# EasyEDA Pro project Master board.epro

# Schematic Schematic1
Board Name: MASTER; Create Date: 2026-03-29; Page Name: P1; Project Name: rs485 master; Schematic Name: Schematic1; Update Date: 2026-04-01; Company: EasyEDA.com; Page Size: A4; Version: V1.0
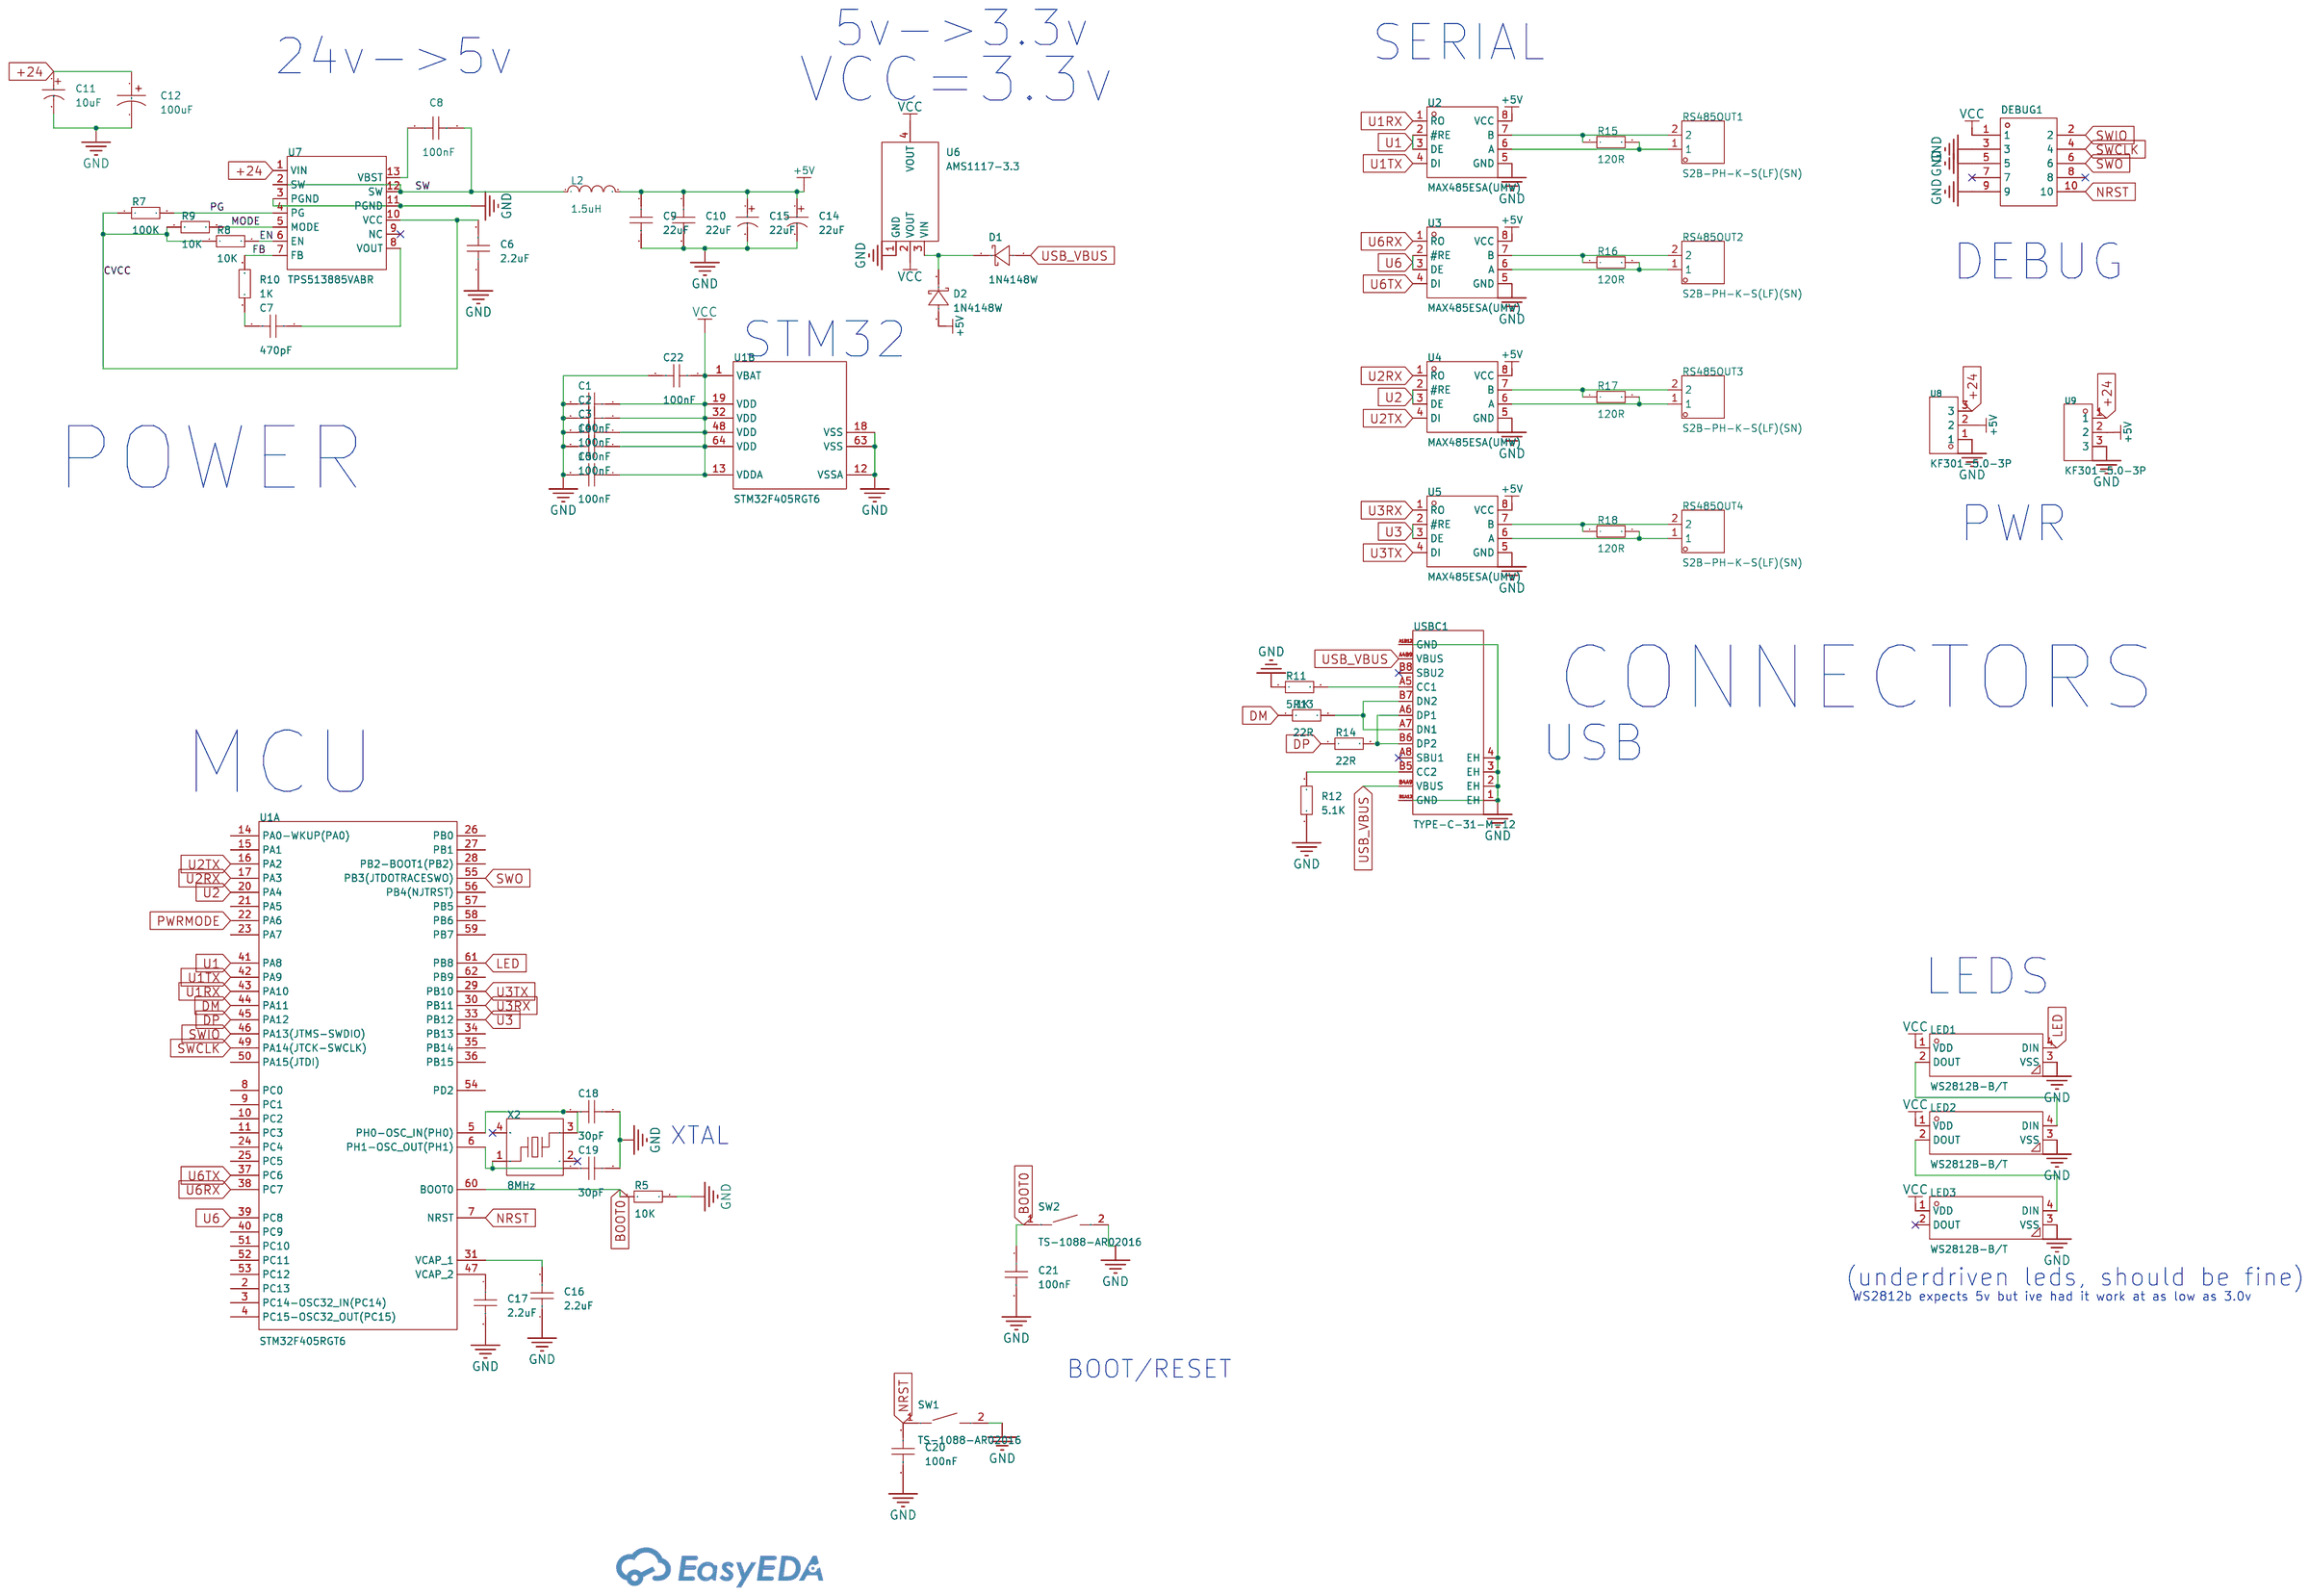
[diagram p0: schematic sheet]

## Parts
C1  100nF  [C0603]
C2  100nF  [C0603]
C3  100nF  [C0603]
C4  100nF  [C0603]
C5  100nF  [C0603]
C6  2.2uF  [C0603]
C7  470pF  [C0603]
C8  100nF  [C0603]
C9  22uF  [C0603]
C10  22uF  [C0603]
C11  10uF  [CAP-TH_BD5.0-P2.00-D0.8-FD]
C12  100uF  [CAP-TH_BD6.0-P2.50-D0.5-FD]
C14  22uF  [CAP-TH_BD4.0-P1.50-D0.8-FD]
C15  22uF  [CAP-TH_BD4.0-P1.50-D0.8-FD]
C16  2.2uF  [C0603]
C17  2.2uF  [C0603]
C18  30pF  [C0603]
C19  30pF  [C0603]
C20  100nF  [C0603]
C21  100nF  [C0603]
C22  100nF  [C0603]
D1  1N4148W  [SOD-123_L2.7-W1.6-LS3.7-FD]
D2  1N4148W  [SOD-123_L2.7-W1.6-LS3.7-FD]
DEBUG1  -  [HDR-TH_10P-P2.54-V-M-R2-C5-S2.54]
L2  1.5uH  [IND-SMD_L7.0-W6.6]
LED1  WS2812B-B/T  [LED-SMD_4P-L5.0-W5.0-TL_WS2812B-B]
LED2  WS2812B-B/T  [LED-SMD_4P-L5.0-W5.0-TL_WS2812B-B]
LED3  WS2812B-B/T  [LED-SMD_4P-L5.0-W5.0-TL_WS2812B-B]
R5  10K  [R0603]
R7  100K  [R0603]
R8  10K  [R0603]
R9  10K  [R0603]
R10  1K  [R0603]
R11  5.1K  [R0603]
R12  5.1K  [R0603]
R13  22R  [R0603]
R14  22R  [R0603]
R15  120R  [R0603]
R16  120R  [R0603]
R17  120R  [R0603]
R18  120R  [R0603]
RS485OUT1  S2B-PH-K-S(LF)(SN)  [CONN-TH_S2B-PH-K-S-LF-SN]
RS485OUT2  S2B-PH-K-S(LF)(SN)  [CONN-TH_S2B-PH-K-S-LF-SN]
RS485OUT3  S2B-PH-K-S(LF)(SN)  [CONN-TH_S2B-PH-K-S-LF-SN]
RS485OUT4  S2B-PH-K-S(LF)(SN)  [CONN-TH_S2B-PH-K-S-LF-SN]
SW1  TS-1088-AR02016  [SW-SMD_L3.9-W3.0-P4.45]
SW2  TS-1088-AR02016  [SW-SMD_L3.9-W3.0-P4.45]
U1  STM32F405RGT6  [LQFP-64_L10.0-W10.0-P0.50-LS12.0-BL]  (sections 1,2)
U2  MAX485ESA(UMW)  [SOP-8_L5.0-W4.0-P1.27-LS6.0-BL]
U3  MAX485ESA(UMW)  [SOP-8_L5.0-W4.0-P1.27-LS6.0-BL]
U4  MAX485ESA(UMW)  [SOP-8_L5.0-W4.0-P1.27-LS6.0-BL]
U5  MAX485ESA(UMW)  [SOP-8_L5.0-W4.0-P1.27-LS6.0-BL]
U6  AMS1117-3.3  [SOT-223-3_L6.5-W3.4-P2.30-LS7.0-BR]
U7  TPS513885VABR  [VQFN-HR-13_L4.0-W3.0_TPS51388VABR]
U8  KF301-5.0-3P  [CONN-TH_3P-P5.00_KF301-5.0-3P]
U9  KF301-5.0-3P  [CONN-TH_3P-P5.00_KF301-5.0-3P]
USBC1  TYPE-C-31-M-12  [USB-C_SMD-TYPE-C-31-M-12_1]
X2  8MHz  [CRYSTAL-SMD_4P-L3.2-W2.5-BL]

## Library data of the parts
C1-C10 C18 C19 C22 = CAP_0603: Supplier Footprint: 0603
C11 = ERS1HM100D11OT: Capacitance:10uF Tolerance:±20% Tolerance:±20% Voltage Rating:50V Pin Spacing:2mm Diameter:5mm Height - Seated (Max):11mm Lifetime:5000hrs@105℃; LCSC Part Name: 10uF ±20% 50V; Supplier Part: C106654; Manufacturer: AISHI(艾华集团); Supplier Footprint: 插件,D5xL11mm; JLCPCB Part Class: Extended Part; Datasheet: https://item.szlcsc.com/datasheet/ERS1HM100D11OT/107870.html; Supplier: LCSC; Tolerance: ±20%; Voltage Rating: 50V; Pin Spacing: 2mm; Diameter: 5mm; Height - Seated (Max): 11mm; Lifetime: 5000hrs@105℃
C12 = KM1V101M0611: Capacitance:100uF Tolerance:±20% Tolerance:±20% Voltage Rating:35V Pin Spacing:- Diameter:6mm Height - Seated (Max):11mm Operating Temperature:-40℃~+105℃ Operating Temperature:-40℃~+105℃; LCSC Part Name: 100uF ±20% 35V; Supplier Part: C2873963; Manufacturer: ROQANG(容强); Supplier Footprint: 插件,D6xL11mm; JLCPCB Part Class: Extended Part; Datasheet: https://item.szlcsc.com/datasheet/KM1V101M0611/3078446.html; Supplier: LCSC; Tolerance: ±20%; Voltage Rating: 35V; Diameter: 6mm; Height - Seated (Max): 11mm; Operating Temperature: -40℃~+105℃
C14 C15 = KS226M025C07RR0VH2FP0: Capacitance:22uF Tolerance:±20% Tolerance:±20% Voltage Rating:25V Ripple Current:- Equivalent Series Resistance(ESR):- Pin Spacing:1.5mm Diameter:4mm Height - Seated (Max):7mm Lifetime:1000hrs@105℃ Operating Temperature:-40℃~+105℃ Operating Temperature:-4; LCSC Part Name: 22uF ±20% 25V; Supplier Part: C43840; Manufacturer: Chengx(承兴); Supplier Footprint: 插件,D4xL7mm; JLCPCB Part Class: Extended Part; Datasheet: https://item.szlcsc.com/datasheet/KS226M025C07RR0VH2FP0/44842.html; Supplier: LCSC; Tolerance: ±20%; Voltage Rating: 25V; Pin Spacing: 1.5mm; Diameter: 4mm; Height - Seated (Max): 7mm; Lifetime: 1000hrs@105℃; Operating Temperature: -40℃~+105℃
C16 C17 C20 C21 = CAP_0603: Supplier Footprint: 0603; Check: false
D1 D2 = 1N4148W_C7420318: Diode Configuration:Independent Voltage - Forward(Vf@If):1.25V@150mA Voltage - DC Reverse(Vr):100V Current - Rectified:150mA Pd - Power Dissipation:400mW Reverse Leakage Current (Ir):1uA@75V Reverse Recovery Time (trr):4ns Operating Junction Temperature R; LCSC Part Name: 100V 150mA; Supplier Part: C7420318; Manufacturer: R+O(宏嘉诚); Supplier Footprint: SOD-123; JLCPCB Part Class: Extended Part; Datasheet: https://item.szlcsc.com/datasheet/1N4148W/8397140.html; Supplier: LCSC; Diode Configuration: Independent; Voltage - Forward(Vf@If): 1.25V@150mA; Voltage - DC Reverse(Vr): 100V; Current - Rectified: 150mA; Pd - Power Dissipation: 400mW; Reverse Leakage Current (Ir): 1uA@75V; Reverse Recovery Time (trr): 4ns; Operating Junction Temperature Range: -55℃~+150℃; Non-Repetitive Peak Forward Surge Current: 2A
DEBUG1 = HDR-M_2.54_2x5: Supplier Footprint: Through; Check: false
L2 = FXL0630-1R5-M: Inductance:1.5uH Tolerance:±20% Tolerance:±20% Current Rating:12A Current - Saturation(Isat):14A DC Resistance(DCR):12.1mΩ Type:Molded Inductor; LCSC Part Name: 1.5uH ±20% 14A; Supplier Part: C167217; Manufacturer: cjiang(长江微电); Supplier Footprint: SMD,7x6.6mm; JLCPCB Part Class: Extended Part; Datasheet: https://item.szlcsc.com/datasheet/FXL0630-1R5-M/178600.html; Supplier: LCSC; Tolerance: ±20%; Current Rating: 12A; Current - Saturation(Isat): 14A; DC Resistance(DCR): 12.1mΩ; Type: Molded Inductor
LED1-LED3 = WS2812B-B/T: Wavelength:520nm；471nm；621nm Luminous Intensity:R:300mcd~500mcd；B:200mcd~300mcd；G:600mcd~1000mcd Fixed-Frequency Pwm Mode:2kHz Data Transmission Rate:800Kbit/s Voltage - Supply:- Voltage - Supply:- Quiescent Current:0.6mA Lens Color:- Peak Wavelength:G:52; LCSC Part Name: RGB三色; Supplier Part: C2761795; Manufacturer: worldsemi; Supplier Footprint: SMD5050-4P; JLCPCB Part Class: Extended Part; Datasheet: https://item.szlcsc.com/datasheet/WS2812B-B%252FT/2886707.html; Supplier: LCSC; Wavelength: 520nm；471nm；621nm; Luminous Intensity: R:300mcd~500mcd；B:200mcd~300mcd；G:600mcd~1000mcd; Fixed-Frequency Pwm Mode: 2kHz; Data Transmission Rate: 800Kbit/s; Quiescent Current: 0.6mA; Peak Wavelength: G:520nm；R:621nm；B:471nm; Length: 5mm; Width: 1.57mm; Height: 5.4mm
R5 = Res_0603: Supplier Footprint: 0603; Check: false
R7-R18 = Res_0603: Supplier Footprint: 0603
RS485OUT1-RS485OUT4 = S2B-PH-K-S(LF)(SN): Pins Structure:1x2P Pitch:2mm Mounting Type:Right Angle Reference Series:PH Number of Pins:2P Number of Rows:1 Number of PINs Per Row:2 Row Spacing:- Current Rating:2A Contact Material:Brass Contact Plating:Tin Operating Temperature:-25℃~+85℃ Operating Te; LCSC Part Name: 1x2P 间距:2mm 弯插 系列:PH; Supplier Part: C173752; Manufacturer: JST; Supplier Footprint: 弯插,P=2mm; JLCPCB Part Class: Extended Part; Datasheet: https://item.szlcsc.com/datasheet/S2B-PH-K-S(LF)(SN)/185142.html; Supplier: LCSC; Pins Structure: 1x2P; Pitch: 2mm; Mounting Type: Right Angle; Reference Series: PH; Number of Pins: 2P; Number of Rows: 1; Number of PINs Per Row: 2; Current Rating: 2A; Contact Material: Brass; Contact Plating: Tin; Operating Temperature: -25℃~+85℃; Voltage Rating: 100V; Plastic Material: PA66; Flame Retardant Rating: UL94V-0; Supplementary Features: K Pin; Color: White; Z-Height of the Board: 4.8mm; X-Length of Bottom Edge on Board (Spacing Line): 5.9mm; Y-Width of Bottom Edge on Board: 7.6mm
SW1 SW2 = TS-1088-AR02016: Circuit:SPST Actuator Style:Round Button Operating Force:1.6N Mounting Type:Surface Mount,Vertical Length:4mm Width:3mm Switch Height:2mm with Bracket:Without Bracket Contact Current:50mA Voltage Rating:12V Actuator/Cap Color:Black Termination Style:SMD(S; LCSC Part Name: 4*3*2mm 立贴 轻触开关; Supplier Part: C720477; Manufacturer: XUNPU(讯普); Supplier Footprint: SMD,4x3mm; JLCPCB Part Class: Basic Part; Datasheet: https://item.szlcsc.com/datasheet/TS-1088-AR02016/763484.html; Supplier: LCSC; Circuit: SPST; Actuator Style: Round Button; Operating Force: 1.6N; Mounting Type: Surface Mount,Vertical; Length: 4mm; Width: 3mm; Switch Height: 2mm; with Bracket: Without Bracket; Contact Current: 50mA; Voltage Rating: 12V; Actuator/Cap Color: Black; Termination Style: SMD(SMT) Tab; Life: 100,000 Cycles; Operating Temperature: -30℃~+80℃
U1 = STM32F405RGT6: CPU Core:ARM-M4 CPU Maximum Speed:168MHz Program Storage Size:1MB Program Memory Type:FLASH Number of I/O:51 ADC (Bit):12bit DAC (Bit):12bit Voltage - Supply:1.8V~3.6V Voltage - Supply:1.8V~3.6V Applications:-; LCSC Part Name: 带DSP和FPU的高性能基础系列ARM Cortex-M4 MCU，具有1 MB Flash、168 MHz CPU和ART加速器; Supplier Part: C15742; Manufacturer: ST(意法半导体); Supplier Footprint: LQFP-64(10x10); JLCPCB Part Class: Extended Part; Datasheet: https://item.szlcsc.com/datasheet/STM32F405RGT6/16424.html; Supplier: LCSC; CPU Core: ARM-M4; CPU Maximum Speed: 168MHz; Program Storage Size: 1MB; Program Memory Type: FLASH; Number of I/O: 51; ADC (Bit): 12bit; DAC (Bit): 12bit; Voltage - Supply: 1.8V~3.6V
U2-U5 = MAX485ESA(UMW): Type:Transceiver Number of Drivers:1 Number of Receivers:1 Voltage - Supply:5V Voltage - Supply:5V Data Rate:2.5Mbps Data Rate:2.5Mbps Number of Nodes:32 Supply Current (Iq):300uA Communication Mode:Half-Duplex; LCSC Part Name: 低功耗、压摆率受限的RS-485/RS-422收发器; Supplier Part: C668206; Manufacturer: UMW(友台半导体); Supplier Footprint: SOP-8; JLCPCB Part Class: Extended Part; Datasheet: https://item.szlcsc.com/datasheet/MAX485ESA(UMW)/698054.html; Supplier: LCSC; Type: Transceiver; Number of Drivers: 1; Number of Receivers: 1; Voltage - Supply: 5V; Data Rate: 2.5Mbps; Number of Nodes: 32; Supply Current (Iq): 300uA; Communication Mode: Half-Duplex
U6 = AMS1117-3.3_C6186: Output Type:Fixed Voltage - Supply:15V Output Voltage:3.3V Output Voltage:3.3V Output Current:1A Power Supply Rejection Ratio (PSRR):72dB@(120Hz) Voltage Dropout:1.1V@(800mA) standby current:5mA Noise:0.003%Vout Features:Over Current Protection；Thermal Sh; LCSC Part Name: 3.3V 1A 15V; Supplier Part: C6186; Manufacturer: AMS; Supplier Footprint: SOT-223; JLCPCB Part Class: Basic Part; Datasheet: https://item.szlcsc.com/datasheet/AMS1117-3.3/6652.html; Supplier: LCSC; Output Type: Fixed; Voltage - Supply: 15V; Output Voltage: 3.3V; Output Current: 1A; Power Supply Rejection Ratio (PSRR): 72dB@(120Hz); Voltage Dropout: 1.1V@(800mA); standby current: 5mA; Noise: 0.003%Vout; Features: Over Current Protection；Thermal Shutdown; Operating Temperature: -40℃~+125℃; Output Configuration: Positive; Number of Outputs: 1
U7 = TPS513885VABR: Function:Buck Voltage - Supply:5.5V~24V Voltage - Supply:5.5V~24V Output Voltage:5.15V Output Voltage:5.15V Output Current:12A Frequency - Switching:560kHz；920kHz Frequency - Switching:560kHz；920kHz Operating Temperature:-20℃~+125℃@(TJ) Operating Temperat; LCSC Part Name: 5.5V至24V、12A同步降压转换器; Supplier Part: C41935536; Manufacturer: TI(德州仪器); Supplier Footprint: VQFN-HR-13(3x4); JLCPCB Part Class: Extended Part; Datasheet: https://www.ti.com.cn/cn/lit/ds/symlink/tps513885.pdf?ts=1736920133660; Supplier: LCSC; Function: Buck; Voltage - Supply: 5.5V~24V; Output Voltage: 5.15V; Output Current: 12A; Frequency - Switching: 560kHz；920kHz; Operating Temperature: -20℃~+125℃@(TJ); Topology: Buck; Quiescent Current: 90uA; Switch tube (built-in/external): Built-in; Output Type: Fixed
U8 U9 = KF301-5.0-3P: Number of Positions or Pins:1x3P Pitch:5mm Color:Blue Mounting Type:Through Hole Number of Pins:3P Number of Rows:1 Number of PINs Per Row:3 Current Rating:17A Voltage Rating (Max):250V Wire Gauge - AWG:14~22 Wire Gauge - mm2:1.5 Wire Gauge - mm2:1.5 Oper; LCSC Part Name: 1x3P 5mm 直插 排数:1 每排P数:3; Supplier Part: C474882; Manufacturer: KEFA(科发); Supplier Footprint: 插件,P=5mm; JLCPCB Part Class: Extended Part; Datasheet: https://item.szlcsc.com/datasheet/KF301-5.0-3P/481500.html; Supplier: LCSC; Number of Positions or Pins: 1x3P; Pitch: 5mm; Color: Blue; Mounting Type: Through Hole; Number of Pins: 3P; Number of Rows: 1; Number of PINs Per Row: 3; Current Rating: 17A; Voltage Rating (Max): 250V; Wire Gauge - AWG: 14~22; Wire Gauge - mm2: 1.5; Operating Temperature: -30℃~+120℃
USBC1 = TYPE-C-31-M-12: Connector Type:Type-C Protocol Standard:- Gender:Female Mounting Type:Surface Mount, Right Angle Number of Contacts:16P Number of Ports:1 Current Rating-Power:5A Voltage Rating:20V Connect-Disconnect Life:10,000 cycles Length:7.35mm Operating Temperature:; LCSC Part Name: Type-C 母 卧贴; Supplier Part: C165948; Manufacturer: 韩国韩荣; Supplier Footprint: SMD; JLCPCB Part Class: Extended Part; Datasheet: https://item.szlcsc.com/datasheet/TYPE-C-31-M-12/177331.html; Supplier: LCSC; Connector Type: Type-C; Gender: Female; Mounting Type: Surface Mount, Right Angle; Number of Contacts: 16P; Number of Ports: 1; Current Rating-Power: 5A; Voltage Rating: 20V; Connect-Disconnect Life: 10,000 cycles; Length: 7.35mm; Operating Temperature: -30℃~+80℃
X2 = X32258MOB4SI: Type:Crystal Oscillator Frequency:8MHz Normal temperature Frequency Tolerance:±10ppm Normal temperature Frequency Tolerance:±10ppm Load Capacitance:12pF Frequency Stability:±20ppm Frequency Stability:±20ppm Equivalent Series Resistance(ESR):150Ω Operating; LCSC Part Name: YSX321SL 8MHZ 4P 3225 12PF ±10PPM -40~85℃ (±20PPM); Supplier Part: C2682775; Manufacturer: YXC(扬兴晶振); Supplier Footprint: SMD3225-4P; JLCPCB Part Class: Extended Part; Datasheet: https://item.szlcsc.com/datasheet/X32258MOB4SI/2777872.html; Supplier: LCSC; Type: Crystal Oscillator; Normal temperature Frequency Tolerance: ±10ppm; Load Capacitance: 12pF; Frequency Stability: ±20ppm; Equivalent Series Resistance(ESR): 150Ω; Operating Temperature: -40℃~+85℃

## Nets
+5V: C9.1 C10.1 C14.1 C15.1 D2.1(A) L2.2 U2.8(VCC) U3.8(VCC) U4.8(VCC) U5.8(VCC) U8.2 U9.2
GND: C1.2 C2.2 C3.2 C4.2 C5.2 C6.1 C9.2 C10.2 C11.2 C12.2 C14.2 C15.2 C16.1 C17.2 C18.2 C19.2 C20.2 C21.2 C22.2 DEBUG1.3 DEBUG1.5 DEBUG1.9 LED1.3(VSS) LED2.3(VSS) LED3.3(VSS) R5.2 R11.1 R12.1 SW1.2 SW2.2 U1.12(VSSA) U1.18(VSS) U1.63(VSS) U2.5(GND) U3.5(GND) U4.5(GND) U5.5(GND) U6.1(GND) U7.3(PGND) U7.11(PGND) U8.1 U9.3 USBC1.1(EH) USBC1.2(EH) USBC1.3(EH) USBC1.4(EH) USBC1.A1B12(GND) USBC1.B1A12(GND)
VCC: C1.1 C2.1 C3.1 C4.1 C5.1 C22.1 DEBUG1.1 LED1.1(VDD) LED2.1(VDD) LED3.1(VDD) U1.1(VBAT) U1.13(VDDA) U1.19(VDD) U1.32(VDD) U1.48(VDD) U1.64(VDD) U6.2(VOUT) U6.4(VOUT)
+24: C11.1 C12.1 U7.1(VIN) U8.3 U9.1
BOOT0: C21.1 R5.1 SW2.1 U1.60(BOOT0)
CVCC: C6.2 R7.1 R8.1 R9.1 U7.10(VCC)
DM: R13.1 U1.44(PA11)
DP: R14.1 U1.45(PA12)
EN: R8.2 U7.6(EN)
FB: R10.2 U7.7(FB)
LED: LED1.4(DIN) U1.61(PB8)
MODE: R9.2 U7.5(MODE)
NRST: C20.1 DEBUG1.10 SW1.1 U1.7(NRST)
PG: R7.2 U7.4(PG)
PWRMODE: U1.22(PA6)
SW: C8.1 L2.1 U7.2(SW) U7.12(SW)
SWCLK: DEBUG1.4 U1.49(PA14(JTCK-SWCLK))
SWIO: DEBUG1.2 U1.46(PA13(JTMS-SWDIO))
SWO: DEBUG1.6 U1.55(PB3(JTDOTRACESWO))
U1: U1.41(PA8) U2.2(#RE) U2.3(DE)
U1RX: U1.43(PA10) U2.1(RO)
U1TX: U1.42(PA9) U2.4(DI)
U2: U1.20(PA4) U4.2(#RE) U4.3(DE)
U2RX: U1.17(PA3) U4.1(RO)
U2TX: U1.16(PA2) U4.4(DI)
U3: U1.33(PB12) U5.2(#RE) U5.3(DE)
U3RX: U1.30(PB11) U5.1(RO)
U3TX: U1.29(PB10) U5.4(DI)
U6: U1.39(PC8) U3.2(#RE) U3.3(DE)
U6RX: U1.38(PC7) U3.1(RO)
U6TX: U1.37(PC6) U3.4(DI)
USB_VBUS: D1.1(A) USBC1.A4B9(VBUS) USBC1.B4A9(VBUS)
$1N1237: R15.2 RS485OUT1.1 U2.6(A)
$1N1239: R15.1 RS485OUT1.2 U2.7(B)
$1N1291: R16.2 RS485OUT2.1 U3.6(A)
$1N1293: R16.1 RS485OUT2.2 U3.7(B)
$1N1345: R17.2 RS485OUT3.1 U4.6(A)
$1N1347: R17.1 RS485OUT3.2 U4.7(B)
$1N1399: R18.2 RS485OUT4.1 U5.6(A)
$1N1401: R18.1 RS485OUT4.2 U5.7(B)
$1N2165: LED1.2(DOUT) LED2.4(DIN)
$1N2171: LED2.2(DOUT) LED3.4(DIN)
$1N3985: C7.2 R10.1
$1N3989: C7.1 U7.8(VOUT)
$1N4111: C8.2 U7.13(VBST)
$1N4926: C16.2 U1.31(VCAP_1)
$1N4958: C17.1 U1.47(VCAP_2)
$1N5388: R14.2 USBC1.A6(DP1) USBC1.B6(DP2)
$1N5394: R13.2 USBC1.A7(DN1) USBC1.B7(DN2)
$1N5476: R12.2 USBC1.B5(CC2)
$1N5480: R11.2 USBC1.A5(CC1)
$1N5683: D1.2(K) D2.2(K) U6.3(VIN)
$1N6012: C19.1 U1.6(PH1-OSC_OUT(PH1)) X2.1
$1N6017: C18.1 U1.5(PH0-OSC_IN(PH0)) X2.3

Not connected (* = marked no-connect by the designer): DEBUG1 7* 8*; LED3 2(DOUT)*; U1 2(PC13) 3(PC14-OSC32_IN(PC14)) 4(PC15-OSC32_OUT(PC15)) 8(PC0) 9(PC1) 10(PC2) 11(PC3) 14(PA0-WKUP(PA0)) 15(PA1) 21(PA5) 23(PA7) 24(PC4) 25(PC5) 26(PB0) 27(PB1) 28(PB2-BOOT1(PB2)) 34(PB13) 35(PB14) 36(PB15) 40(PC9) 50(PA15(JTDI)) 51(PC10) 52(PC11) 53(PC12) 54(PD2) 56(PB4(NJTRST)) 57(PB5) 58(PB6) 59(PB7) 62(PB9); U7 9(NC)*; USBC1 A8(SBU1)* B8(SBU2)*; X2 2(GND)* 4(GND)*

## Notes on the sheet
- 5v->3.3v
- SERIAL
- 24v->5v
- VCC=3.3v
- DEBUG
- STM32
- POWER
- PWR
- CONNECTORS
- USB
- MCU
- LEDS
- XTAL
- (underdriven leds, should be fine)
- WS2812b expects 5v but ive had it work at as low as 3.0v
- BOOT/RESET

# Schematic Schematic2
Board Name: TERM; Create Date: 2026-04-01; Page Name: P1; Project Name: rs485 master; Schematic Name: Schematic2; Update Date: 2026-04-01; Company: EasyEDA.com; Page Size: A4; Version: V1.0
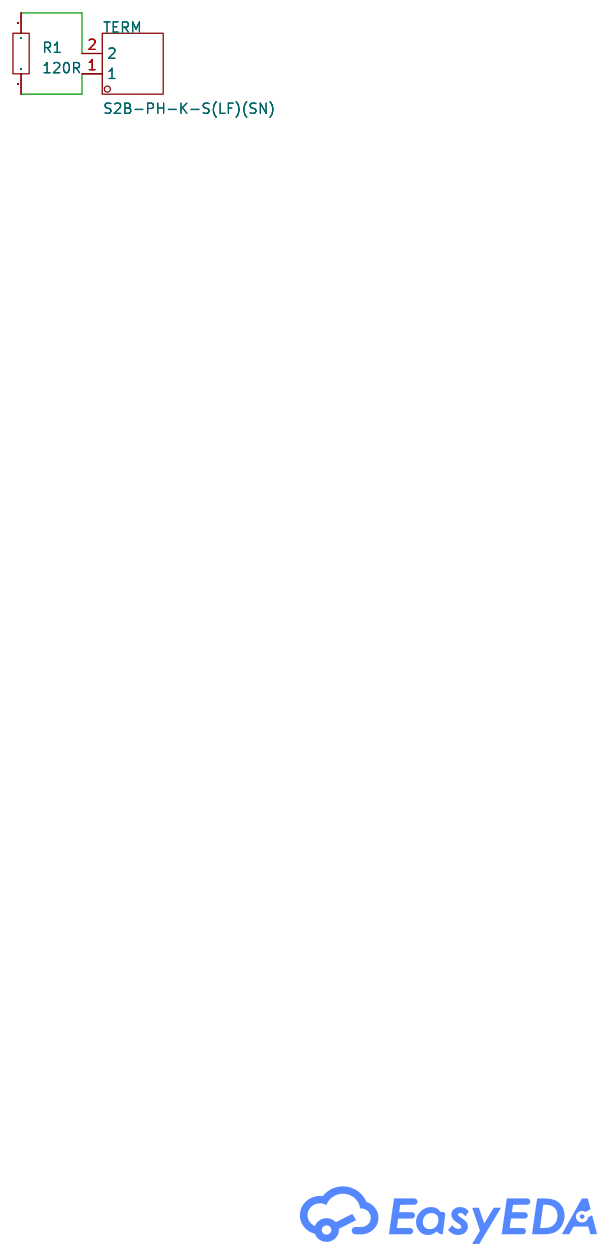
[diagram p1: schematic sheet]

## Parts
R1  120R  [R0603]
TERM  S2B-PH-K-S(LF)(SN)  [CONN-TH_S2B-PH-K-S-LF-SN]

## Library data of the parts
R1 = Res_0603: Supplier Footprint: 0603
TERM = S2B-PH-K-S(LF)(SN): Pins Structure:1x2P Pitch:2mm Mounting Type:Right Angle Reference Series:PH Number of Pins:2P Number of Rows:1 Number of PINs Per Row:2 Row Spacing:- Current Rating:2A Contact Material:Brass Contact Plating:Tin Operating Temperature:-25℃~+85℃ Operating Te; LCSC Part Name: 1x2P 间距:2mm 弯插 系列:PH; Supplier Part: C173752; Manufacturer: JST; Supplier Footprint: 弯插,P=2mm; JLCPCB Part Class: Extended Part; Datasheet: https://item.szlcsc.com/datasheet/S2B-PH-K-S(LF)(SN)/185142.html; Supplier: LCSC; Pins Structure: 1x2P; Pitch: 2mm; Mounting Type: Right Angle; Reference Series: PH; Number of Pins: 2P; Number of Rows: 1; Number of PINs Per Row: 2; Current Rating: 2A; Contact Material: Brass; Contact Plating: Tin; Operating Temperature: -25℃~+85℃; Voltage Rating: 100V; Plastic Material: PA66; Flame Retardant Rating: UL94V-0; Supplementary Features: K Pin; Color: White; Z-Height of the Board: 4.8mm; X-Length of Bottom Edge on Board (Spacing Line): 5.9mm; Y-Width of Bottom Edge on Board: 7.6mm

## Nets
$1N137: R1.1 TERM.2
$1N142: R1.2 TERM.1

# Board PCB1
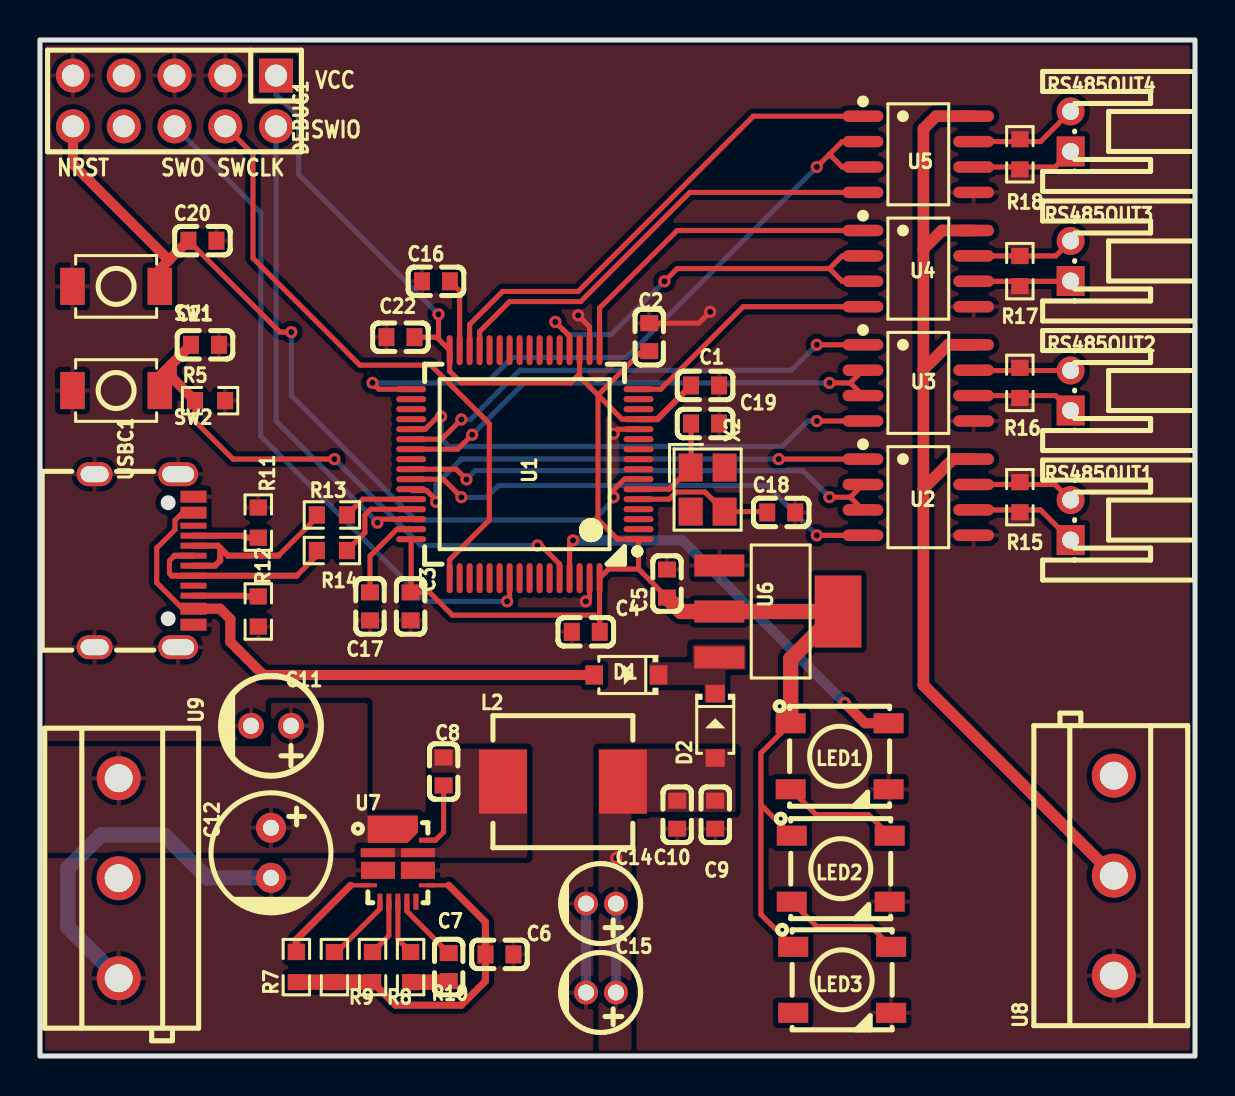
[diagram p2: board, top side]
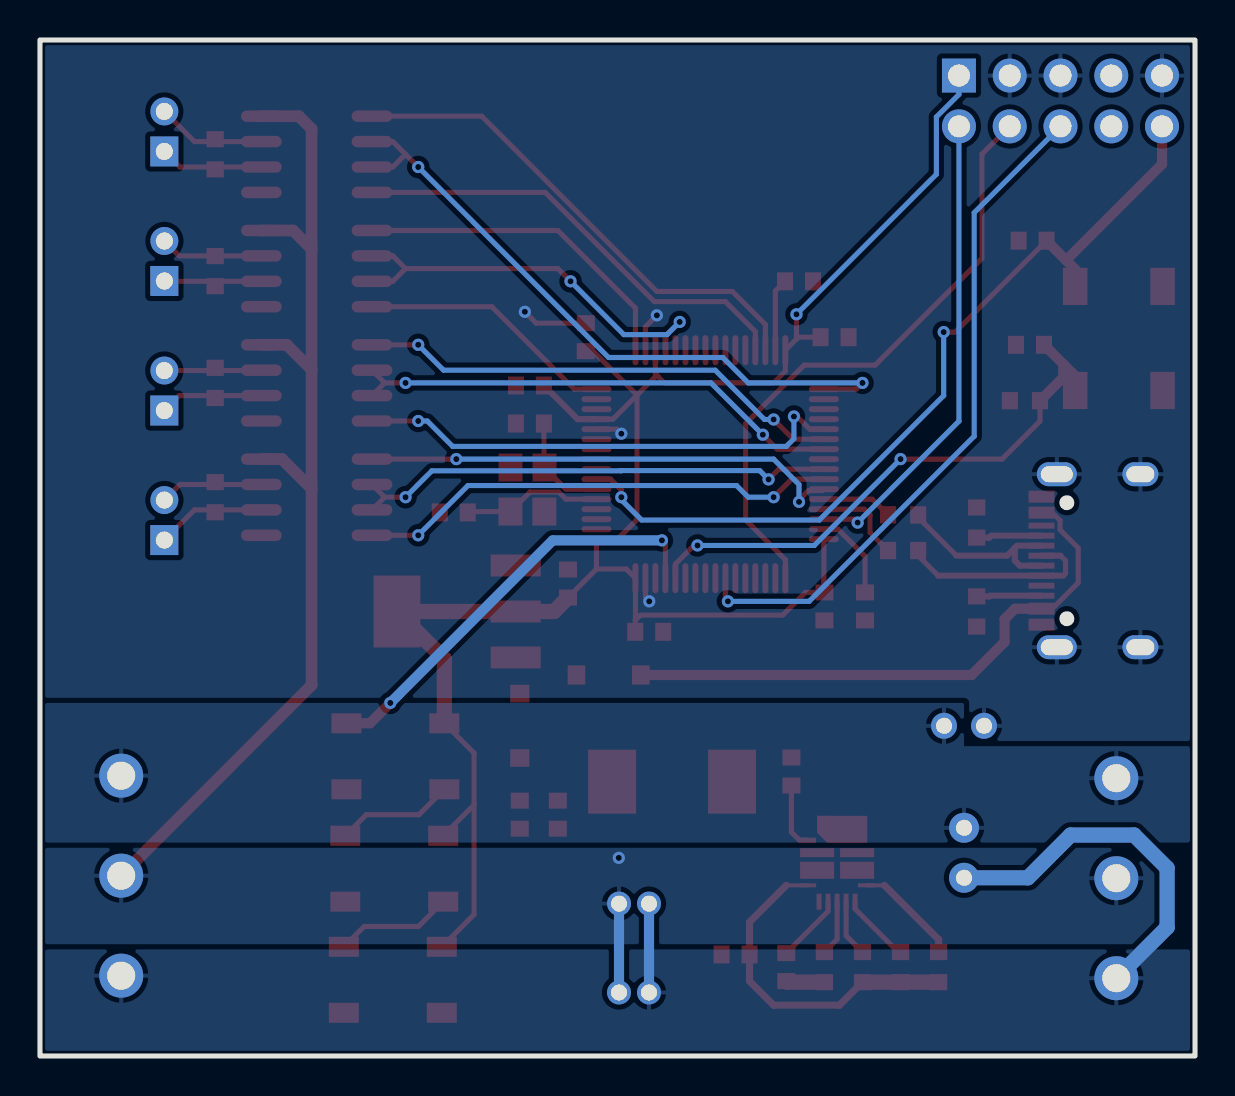
[diagram p3: board, bottom side, seen from below]

Outline 57.79 x 50.8 mm; copper layers: Top Layer, Bottom Layer. Coordinates in mm from the lower left corner of the outline.
Outline path: rectangle 0,50.8 57.79,0
Stack: Top Layer 0.035mm / Dielectric1 1.51mm FR4 er 4.5 / Bottom Layer 0.035mm

## Design rules (mm)
template: Custom Config
spacing copperThickness1oz (default): track to track 0.102, other pairs 0.152 to 0.3
spacing copperThickness2oz: track to track 0.203, other pairs 0.152 to 0.3
track width copperThickness1oz (default): min 0.127, default 0.254, max 2.54
track width copperThickness2oz: min 0.203, default 0.254, max 2.54
differential pair differentialPair (default): width min 0.127, default 0.254, max 2.54; gap min 0.152, default 0.152
via viaSize (default): diameter min 0.5, default 0.61, max 10; hole min 0.3, default 0.305, max 6.3
net +5V uses copperRegion2
pour e133 uses copperRegion1
pour e193 uses copperRegion2
pour e3754 uses copperRegion1

## Placement (name value [footprint] x y rotation side)
C1  100nF  [C0603]  33.27 33.53 0 top
C2  100nF  [C0603]  30.48 35.94 90 top
C3  100nF  [C0603]  18.54 22.48 270 top
C4  100nF  [C0603]  27.3 21.21 180 top
C5  100nF  [C0603]  31.37 23.62 90 top
C6  2.2uF  [C0603]  22.99 5.08 180 top
C7  470pF  [C0603]  20.45 4.44 270 top
C8  100nF  [C0603]  20.19 14.22 270 top
C9  22uF  [C0603]  33.78 12.06 270 top
C10  22uF  [C0603]  31.88 12.06 270 top
C11  10uF  [CAP-TH_BD5.0-P2.00-D0.8-FD]  11.56 16.51 180 top
C12  100uF  [CAP-TH_BD6.0-P2.50-D0.5-FD]  11.56 10.16 270 top
C14  22uF  [CAP-TH_BD4.0-P1.50-D0.8-FD]  28.07 7.62 180 top
C15  22uF  [CAP-TH_BD4.0-P1.50-D0.8-FD]  28.07 3.17 180 top
C16  2.2uF  [C0603]  19.81 38.73 0 top
C17  2.2uF  [C0603]  16.51 22.48 270 top
C18  30pF  [C0603]  37.08 27.18 0 top
C19  30pF  [C0603]  33.27 31.62 0 top
C20  100nF  [C0603]  8.13 40.77 0 top
C21  100nF  [C0603]  8.26 35.56 0 top
C22  100nF  [C0603]  18.03 35.94 180 top
D1  1N4148W  [SOD-123_L2.7-W1.6-LS3.7-FD]  29.34 19.05 0 top
D2  1N4148W  [SOD-123_L2.7-W1.6-LS3.7-FD]  33.78 16.51 90 top
DEBUG1  -  [HDR-TH_10P-P2.54-V-M-R2-C5-S2.54]  6.73 47.75 180 top
L2  1.5uH  [IND-SMD_L7.0-W6.6]  26.16 13.72 0 top
LED1  WS2812B-B/T  [LED-SMD_4P-L5.0-W5.0-TL_WS2812B-B]  40.01 14.99 0 top
LED2  WS2812B-B/T  [LED-SMD_4P-L5.0-W5.0-TL_WS2812B-B]  40.06 9.37 0 top
LED3  WS2812B-B/T  [LED-SMD_4P-L5.0-W5.0-TL_WS2812B-B]  40.13 3.81 0 top
R5  10K  [R0603]  8.51 32.77 0 top
R7  100K  [R0603]  12.83 4.44 90 top
R8  10K  [R0603]  16.64 4.44 90 top
R9  10K  [R0603]  14.73 4.44 90 top
R10  1K  [R0603]  18.54 4.44 90 top
R11  5.1K  [R0603]  10.92 26.67 270 top
R12  5.1K  [R0603]  10.92 22.22 90 top
R13  22R  [R0603]  14.61 27.05 180 top
R14  22R  [R0603]  14.61 25.27 180 top
R15  120R  [R0603]  49.02 27.94 270 top
R16  120R  [R0603]  49.02 33.65 270 top
R17  120R  [R0603]  49.02 39.24 270 top
R18  120R  [R0603]  49.02 45.08 270 top
RS485OUT1  S2B-PH-K-S(LF)(SN)  [CONN-TH_S2B-PH-K-S-LF-SN]  51.56 26.8 270 top
RS485OUT2  S2B-PH-K-S(LF)(SN)  [CONN-TH_S2B-PH-K-S-LF-SN]  51.56 33.27 270 top
RS485OUT3  S2B-PH-K-S(LF)(SN)  [CONN-TH_S2B-PH-K-S-LF-SN]  51.56 39.75 270 top
RS485OUT4  S2B-PH-K-S(LF)(SN)  [CONN-TH_S2B-PH-K-S-LF-SN]  51.56 46.23 270 top
SW1  TS-1088-AR02016  [SW-SMD_L3.9-W3.0-P4.45]  3.81 38.48 180 top
SW2  TS-1088-AR02016  [SW-SMD_L3.9-W3.0-P4.45]  3.81 33.27 180 top
U1  STM32F405RGT6  [LQFP-64_L10.0-W10.0-P0.50-LS12.0-BL]  24.26 29.59 90 top
U2  MAX485ESA(UMW)  [SOP-8_L5.0-W4.0-P1.27-LS6.0-BL]  43.94 27.94 270 top
U3  MAX485ESA(UMW)  [SOP-8_L5.0-W4.0-P1.27-LS6.0-BL]  43.94 33.65 270 top
U4  MAX485ESA(UMW)  [SOP-8_L5.0-W4.0-P1.27-LS6.0-BL]  43.94 39.37 270 top
U5  MAX485ESA(UMW)  [SOP-8_L5.0-W4.0-P1.27-LS6.0-BL]  43.94 45.08 270 top
U6  AMS1117-3.3  [SOT-223-3_L6.5-W3.4-P2.30-LS7.0-BR]  36.96 22.22 180 top
U7  TPS513885VABR  [VQFN-HR-13_L4.0-W3.0_TPS51388VABR]  17.91 9.52 0 top
U8  KF301-5.0-3P  [CONN-TH_3P-P5.00_KF301-5.0-3P]  53.72 9.02 90 top
U9  KF301-5.0-3P  [CONN-TH_3P-P5.00_KF301-5.0-3P]  3.94 8.89 270 top
USBC1  TYPE-C-31-M-12  [USB-C_SMD-TYPE-C-31-M-12_1]  5.21 24.76 270 top
X2  8MHz  [CRYSTAL-SMD_4P-L3.2-W2.5-BL]  33.4 28.32 270 top

## Footprints (pads in the part's own frame, mm; a bottom-side part is the same pattern mirrored in y, then rotated)
C0603
  rect 0.8x0.9 smd: 1(-0.7,0) 2(0.7,0)
CAP-TH_BD4.0-P1.50-D0.8-FD
  round 1.2 hole 0.8: 1(-0.75,0) 2(0.75,0)
CAP-TH_BD5.0-P2.00-D0.8-FD
  round 1.3 hole 0.8: 1(-1,0) 2(1,0)
CAP-TH_BD6.0-P2.50-D0.5-FD
  round 1.5 hole 0.8: 1(-1.25,0) 2(1.25,0)
CONN-TH_3P-P5.00_KF301-5.0-3P
  round 2.2 hole 1.4: 1(-5,0) 2(0,0) 3(5,0)
CONN-TH_S2B-PH-K-S-LF-SN
  rect 1.5x1.4 hole 0.85: 1(1,0)
  round 1.4 hole 0.85: 2(-1,0)
CRYSTAL-SMD_4P-L3.2-W2.5-BL
  rect 1.4x1.2 smd: 1(-1.1,-0.85) 2(1.1,-0.85) 3(1.1,0.85) 4(-1.1,0.85)
HDR-TH_10P-P2.54-V-M-R2-C5-S2.54
  rect 1.7x1.7 hole 1.1: 1(-5.08,-1.27)
  round 1.7 hole 1.1: 2(-5.08,1.27) 3(-2.54,-1.27) 4(-2.54,1.27) 5(0,-1.27) 6(0,1.27) 7(2.54,-1.27) 8(2.54,1.27) 9(5.08,-1.27) 10(5.08,1.27)
IND-SMD_L7.0-W6.6
  rect 2.4x3.2 smd: 1(-3,0) 2(3,0)
LED-SMD_4P-L5.0-W5.0-TL_WS2812B-B
  rect 1.5x1 smd: 1(-2.45,1.65) 2(-2.45,-1.65) 3(2.45,-1.65) 4(2.45,1.65)
LQFP-64_L10.0-W10.0-P0.50-LS12.0-BL
  oval 0.3x1.5 smd: 1(-3.75,-5.688) 2(-3.25,-5.688) 3(-2.75,-5.688) 4(-2.25,-5.688) 5(-1.75,-5.688) 6(-1.25,-5.688) 7(-0.75,-5.688) 8(-0.25,-5.688) 9(0.25,-5.688) 10(0.75,-5.688) 11(1.25,-5.688) 12(1.75,-5.688) 13(2.25,-5.688) 14(2.75,-5.688) 15(3.25,-5.688) 16(3.75,-5.688) 33(3.75,5.688) 34(3.25,5.688) 35(2.75,5.688) 36(2.25,5.688) 37(1.75,5.688) 38(1.25,5.688) 39(0.75,5.688) 40(0.25,5.688) 41(-0.25,5.688) 42(-0.75,5.688) 43(-1.25,5.688) 44(-1.75,5.688) 45(-2.25,5.688) 46(-2.75,5.688) 47(-3.25,5.688) 48(-3.75,5.688)
  oval 1.5x0.3 smd: 17(5.7,-3.738) 18(5.7,-3.238) 19(5.7,-2.738) 20(5.7,-2.238) 21(5.7,-1.738) 22(5.7,-1.238) 23(5.7,-0.739) 24(5.7,-0.238) 25(5.7,0.262) 26(5.7,0.762) 27(5.7,1.262) 28(5.7,1.762) 29(5.7,2.261) 30(5.7,2.762) 31(5.7,3.261) 32(5.7,3.762) 49(-5.7,3.762) 50(-5.7,3.261) 51(-5.7,2.762) 52(-5.7,2.261) 53(-5.7,1.762) 54(-5.7,1.262) 55(-5.7,0.762) 56(-5.7,0.262) 57(-5.7,-0.238) 58(-5.7,-0.739) 59(-5.7,-1.238) 60(-5.7,-1.738) 61(-5.7,-2.238) 62(-5.7,-2.738) 63(-5.7,-3.238) 64(-5.7,-3.738)
R0603
  rect 0.806x0.864 smd: 1(-0.753,0) 2(0.753,0)
SOD-123_L2.7-W1.6-LS3.7-FD
  rect 0.88x0.96 smd: 1(-1.61,0) 2(1.61,0)
SOP-8_L5.0-W4.0-P1.27-LS6.0-BL
  oval 0.574x2.035 smd: 1(-1.905,-2.768) 2(-0.635,-2.768) 3(0.635,-2.768) 4(1.905,-2.768) 5(1.905,2.768) 6(0.635,2.768) 7(-0.635,2.768) 8(-1.905,2.768)
SOT-223-3_L6.5-W3.4-P2.30-LS7.0-BR
  rect 2.5x1.1 smd: 1(2.97,-2.3) 2(2.97,0) 3(2.97,2.3)
  rect 2.34x3.6 smd: 4(-2.97,0)
SW-SMD_L3.9-W3.0-P4.45
  rect 1.23x1.86 smd: 1(-2.185,0) 2(2.185,0)
USB-C_SMD-TYPE-C-31-M-12_1
  oval 1.2x2 hole 0.8x1.6: 1(4.325,1.706) 4(-4.325,1.706)
  oval 1.2x1.8 hole 0.8x1.4: 2(4.325,-2.474) 3(-4.325,-2.474)
  custom 0.6x1.3 smd: A1B12(-3.2,2.474) A4B9(-2.4,2.474) B1A12(3.2,2.474) B4A9(2.401,2.474)
  rect 0.3x1.3 smd: A5(-1.25,2.474) A6(-0.25,2.474) A7(0.25,2.474) A8(1.25,2.474) B5(1.75,2.474) B6(0.75,2.474) B7(-0.75,2.474) B8(-1.75,2.474)
VQFN-HR-13_L4.0-W3.0_TPS51388VABR
  custom 2.515x1.36 smd: 1(-0.257,1.81)
  rect 1.7x0.45 smd: 2(-1,0.64) 12(1,0.64)
  rect 1.7x0.85 smd: 3(-1,-0.24) 11(1,-0.24)
  rect 0.8x0.2 smd: 4(-1.45,-0.99) 10(1.45,-0.99)
  rect 0.25x0.8 smd: 5(-0.9,-1.81) 6(-0.45,-1.81) 7(0,-1.81) 8(0.45,-1.81) 9(0.9,-1.81)
  rect 0.8x0.25 smd: 13(1.45,1.265)

## Nets
As in the schematic.

Pads without a net: DEBUG1 7 8; LED3 2; U1 2 3 4 8 9 10 11 14 15 21 23 24 25 26 27 28 34 35 36 40 50 51 52 53 54 56 57 58 59 62; U7 9; USBC1 A8 B8; X2 2 4

## Via types
v1: diameter 0.61, hole 0.305, Top Layer to Bottom Layer, 30 vias

## Routing (per net, layer and track width the routed paths; a pad name or vN(x,y) marks a point on that pad's centre or on a via; arc(x,y) is an arc through that point)
+5V: length 57.6
  Top Layer w0.584: 44.2,28.37 44.2,18.54 U8.2 ; 44.2,28.37 44.2,34.32 ; 44.2,28.37 45.68,29.84 U2.8 ; 44.2,34.32 44.2,40.35 ; 44.2,34.32 45.44,35.56 U3.8 ; 44.2,40.35 44.2,46.35 44.83,46.99 U5.8 ; 44.2,40.35 45.12,41.27 U4.8
  Bottom Layer w0.508: C15.1 C14.1
  vias: v1(28.83,9.91)
GND: length 30.6
  Top Layer w0.254: v1(33.53,37.21) 32.96,36.64 C2.2 ; v1(27.3,22.73) 27.49,22.92 U1.63 ; v1(28.7,31.11) 28.93,31.34 U1.12 ; U1.18 27.49,36.46 v1(26.92,37.03)
  Bottom Layer w0.508: C14.2 C15.2
  Bottom Layer w0.762: U9.3 1.4,6.43 1.4,9.4 3.05,11.05 6.22,11.05 8.36,8.91 C12.2
VCC: length 98.3
  Top Layer w0.254: U1.48 18.57,23.21 C3.1 19.49,23.18 20.63,22.04 27.74,22.04 27.99,21.79 ; C22.1 19.85,35.94 19.94,35.85 ; 27.99,21.79 U1.64 28.45,24.35 29.95,24.35 ; 27.99,21.79 28.01,21.78 C4.1 ; 36.07,12.56 36.07,15.15 LED1.1 ; 36.07,12.56 LED2.1 ; 36.07,12.56 36.07,7.07 LED3.1 ; 19.94,35.85 U1.32 20.49,34.24 21.08,33.65 26.54,33.65 26.99,34.11 ; 19.94,35.85 v1(19.94,37.08) ; C2.1 30.11,35.24 27.92,33.04 ; 27.92,33.04 26.99,33.96 26.99,34.11 ; 27.92,33.04 29.12,31.84 U1.13 ; 27.92,33.04 27.92,26.82 28.9,25.84 U1.1 29.95,24.35 ; 26.99,34.11 U1.19 ; 29.95,24.35 31.37,22.92
  Top Layer w0.305: U1.13 30.89,31.84 C1.1
  Top Layer w0.762: LED1.1 37.55,19.85 U6.4 U6.2 32.07,22.22 31.37,22.92
  Bottom Layer w0.254: DEBUG1.1 11.81,48.08 12.94,46.95 12.94,44.08 v1(19.94,37.08)
BOOT0: length 28.2
  Top Layer w0.254: U1.60 25.99,24.6 24.98,25.61 v1(24.89,25.53) ; v1(14.73,29.84) 9.65,29.84 7.76,31.74 R5.1
  Top Layer w0.508: 6.59,34.6 6.59,33.93 R5.1 ; 6.59,34.6 7.55,35.56 ; 6.59,34.6 6,34 SW2.1
  Bottom Layer w0.254: v1(14.73,29.84) 19.05,25.53 v1(24.89,25.53)
CVCC: length 17.1
  Top Layer w0.203: U7.10 20.45,8.53
  Top Layer w0.355: 20.45,8.53 22.29,6.69 C6.2 22.29,3.74 21.08,2.54 17.79,2.54 R8.1
  Top Layer w0.762: R7.1 R9.1 R8.1
DM: length 3.5
  Top Layer w0.254: R13.1 16.15,27.84 U1.44
DP: length 4.6
  Top Layer w0.254: R14.1 16.26,26.17 16.26,27.05 16.55,27.34 U1.45
EN: length 2.9
  Top Layer w0.254: U7.6 17.46,6.02 R8.2
FB: length 2.8
  Top Layer w0.254: U7.7 17.91,5.83 R10.2
LED: length 21.5
  Top Layer w0.254: U1.61 26.49,25.61 v1(26.67,25.78)
  Top Layer w0.508: LED1.4 41.28,16.64 v1(40.26,17.65)
  Bottom Layer w0.508: v1(26.67,25.78) 32.13,25.78 v1(40.26,17.65)
MODE: length 3.5
  Top Layer w0.254: U7.5 17.01,7.35 14.85,5.2 R9.2
NRST: length 42.9
  Top Layer w0.254: C20.1 12,36.19 v1(12.57,36.19) ; v1(28.7,27.94) 28.7,28.3 29.24,28.84 U1.7
  Top Layer w0.508: 6.45,39.79 6,39.33 SW1.1 ; 6.45,39.79 C20.1 ; 6.45,39.79 1.65,44.59 DEBUG1.10
  Bottom Layer w0.254: v1(28.7,27.94) 28.7,27.81 27.69,26.8 18.8,26.8 12.57,33.02 v1(12.57,36.19)
PG: length 5.4
  Top Layer w0.203: 15.54,8.53 U7.4
  Top Layer w0.355: R7.2 12.83,5.82 15.54,8.53
SWCLK: length 31
  Top Layer w0.254: U1.49 20.49,24.81 22.48,26.8 22.48,31.62 19.56,34.54 16,34.54 10.66,39.89 10.66,45.09 DEBUG1.4
SWIO: length 23.7
  Top Layer w0.254: U1.46 17.05,26.84 v1(16.88,26.67)
  Bottom Layer w0.254: v1(16.88,26.67) 11.81,31.74 DEBUG1.2
SWO: length 34.2
  Top Layer w0.254: U1.55 23.49,22.86 v1(23.37,22.73)
  Bottom Layer w0.254: DEBUG1.6 11.05,42.16 11.05,30.99 19.3,22.73 v1(23.37,22.73)
U1: length 24.7
  Top Layer w0.254: 40.54,27.94 U2.2 ; 40.54,27.94 U2.3 ; 40.54,27.94 v1(39.5,27.94) ; v1(21.34,28.83) 20.82,29.34 U1.41
  Bottom Layer w0.254: v1(21.34,28.83) 21.78,29.27 28.7,29.27 28.71,29.26 38.18,29.26 v1(39.5,27.94)
U1RX: length 24.3
  Top Layer w0.254: U1.43 18.64,28.27 19.35,28.27 19.81,27.8 v1(19.81,27.71) ; v1(36.96,29.84) U2.1
  Bottom Layer w0.254: v1(19.81,27.71) 19.81,28.57 21.08,29.84 v1(36.96,29.84)
U1TX: length 24.3
  Top Layer w0.254: v1(38.86,26.03) U2.4 ; v1(21.08,27.94) 20.18,28.84 U1.42
  Bottom Layer w0.254: v1(21.08,27.94) 22.35,27.94 22.94,28.52 36.37,28.52 v1(38.86,26.03)
U2: length 20.9
  Top Layer w0.254: U4.3 40.13,38.73 39.5,39.37 ; 39.5,39.37 31.88,39.37 v1(31.24,38.73) ; 39.5,39.37 40.13,40 U4.2 ; U1.20 26.49,35.99 26.42,36.06 26.42,36.07 26.17,36.32 26.16,36.32 v1(25.78,36.7)
  Bottom Layer w0.254: v1(25.78,36.7) 26.42,36.07 28.58,36.07 v1(31.24,38.73)
U2RX: length 16.9
  Top Layer w0.254: U4.1 31.88,41.27 27.99,37.39 U1.17
U2TX: length 12.9
  Top Layer w0.254: U4.4 35.18,37.46 31.05,33.34 U1.16
U3: length 33.5
  Top Layer w0.254: v1(16.64,33.65) 16.95,33.34 U1.33 ; 41.17,45.72 40.13,45.72 39.5,45.08 ; U5.3 40.13,44.45 39.5,45.08 ; 39.5,45.08 v1(38.86,44.45)
  Bottom Layer w0.254: v1(16.64,33.65) 22.35,33.65 23.62,34.92 29.34,34.92 v1(38.86,44.45)
U3RX: length 25.3
  Top Layer w0.254: U1.30 21.49,36.58 23.15,38.23 26.92,38.23 35.69,46.99 U5.1
U3TX: length 23
  Top Layer w0.254: U1.29 22,36.22 23.49,37.72 27.05,37.72 32.51,43.18 U5.4
U6: length 25.1
  Top Layer w0.254: v1(39.5,33.65) 40.54,33.65 ; 40.54,33.65 U3.3 ; 40.54,33.65 U3.2 ; U1.39 20.9,30.34 v1(21.62,31.06)
  Bottom Layer w0.254: v1(21.62,31.06) 24.21,33.65 v1(39.5,33.65)
U6RX: length 24.6
  Top Layer w0.254: U1.38 20.1,30.84 v1(21.08,31.83) ; v1(38.86,35.56) U3.1
  Bottom Layer w0.254: v1(21.08,31.83) 21.54,31.83 24,34.29 37.59,34.29 v1(38.86,35.56)
U6TX: length 24.7
  Top Layer w0.254: v1(38.86,31.75) U3.4 ; v1(20.07,31.98) 19.91,31.98 19.28,31.34 U1.37
  Bottom Layer w0.254: v1(38.86,31.75) 38.41,31.75 37.14,30.48 20.45,30.48 20.07,30.86 v1(20.07,31.98)
USB_VBUS: length 29.1
  Top Layer w0.254: USBC1.A4B9 7.14,27.16 6.75,26.78 6.75,26.31 5.84,25.4 5.84,23.66 7.14,22.36 USBC1.B4A9
  Top Layer w0.508: USBC1.B4A9 9,22.36 9.52,21.84 9.52,20.7 11.18,19.05 27.73,19.05
$1N1237: length 5.5
  Top Layer w0.254: RS485OUT1.1 50.05,27.3 U2.6
$1N1239: length 5.2
  Top Layer w0.254: RS485OUT1.2 50.78,28.57 U2.7
$1N1291: length 5.2
  Top Layer w0.254: U3.6 50.82,33.02 RS485OUT2.1
$1N1293: length 4.9
  Top Layer w0.254: U3.7 46.73,34.27 RS485OUT2.2
$1N1345: length 4.9
  Top Layer w0.254: U4.6 51.55,38.73 RS485OUT3.1
$1N1347: length 5.2
  Top Layer w0.254: RS485OUT3.2 50.82,40 U4.7
$1N1399: length 5.2
  Top Layer w0.254: RS485OUT4.1 50.78,44.45 U5.6
$1N1401: length 5.5
  Top Layer w0.254: RS485OUT4.2 50.05,45.72 46.71,45.72
$1N2165: length 5.9
  Top Layer w0.254: LED1.2 38.83,12.06 41.46,12.06 42.51,11.02
$1N2171: length 5.9
  Top Layer w0.254: LED2.2 38.85,6.48 41.57,6.48 LED3.4
$1N3985: length 1.9
  Top Layer w0.762: R10.1 20.39,3.69 C7.2
$1N3989: length 3.4
  Top Layer w0.254: U7.8 18.36,7.23 C7.1
$1N4111: length 3.3
  Top Layer w0.254: C8.2 20.19,11.2 19.79,10.79 U7.13
$1N4926: length 3.6
  Top Layer w0.254: C16.2 21,38.25 U1.31
$1N4958: length 4.4
  Top Layer w0.254: C17.1 16.51,24.99 17.86,26.34 U1.47
$1N5388: length 10
  Top Layer w0.254: 6.59,24.01 6.48,24.13 6.48,24.76 6.73,25.01 ; 12.85,24.01 13.85,25.02 R14.2
  Top Layer w0.305: 12.85,24.01 USBC1.B6 6.59,24.01 ; USBC1.A6 6.73,25.01
$1N5394: length 9.4
  Top Layer w0.254: R13.2 13.85,26.93 11.94,25.02
  Top Layer w0.305: 9.02,25.4 9.02,24.77 8.76,24.51 USBC1.A7 ; 9.02,25.4 8.9,25.51 USBC1.B7 ; 9.02,25.4 9.4,25.02 11.94,25.02
$1N5476: length 3.3
  Top Layer w0.305: R12.2 10.29,22.98 10.25,23.01 USBC1.B5
$1N5480: length 3.3
  Top Layer w0.305: R11.2 10.29,25.92 10.19,26.01 USBC1.A5
$1N6012: length 5.3
  Top Layer w0.254: U1.6 31.47,28.34 X2.1 32.57,29.44 C19.1
$1N6017: length 7
  Top Layer w0.254: C18.1 36.34,27.22 X2.3 34.25,27.22 33.27,28.2 31.84,28.2 31.48,27.84 U1.5

## Copper pours and planes (outline as drawn; the poured copper is in the pictures)
+5V on Top Layer: 27.94,15.37 27.94,-2.56 29.59,-2.56 29.59,12.19 34.8,12.19 34.8,15.37
+5V on Bottom Layer: -0.76,10.54 58.42,10.54 58.42,5.59 -0.76,5.59
GND on Top Layer: -3.3,50.8 62.23,50.8 62.23,-2.41 -3.3,-2.41
GND on Bottom Layer: -6.1,54.23 63.25,54.23 63.25,13.59 -6.1,13.59
GND on Bottom Layer: -1.91,5.46 57.79,5.46 57.79,-0.51 -1.91,-0.51
+24 on Top Layer: 17.91,10.16 18.92,11.18 18.92,12.06 16.38,12.06 16.38,17.65 11.56,17.65 11.56,15.49 -0.63,15.49 -0.63,10.16
+24 on Bottom Layer: -0.25,10.67 -0.25,15.49 11.56,15.49 11.56,17.65 57.91,17.65 57.91,10.67
SW on Top Layer: 16,10.41 16,9.91 24.38,9.91 24.38,15.37 19.56,15.37 19.56,10.41
$1N5683 on Top Layer: 35.31,20.57 35.31,19.3 34.29,19.3 34.29,17.65 33.24,17.65 33.24,18.54 30.48,18.54 30.48,19.68 32.64,19.68 32.64,20.57

Small or netless copper shapes (teardrops, artwork), in the pictures only: 4 on Top Layer

## Text on the board
Top Silkscreen Layer: SWIO | VCC | NRST | SWO | SWCLK

# Board PCB2
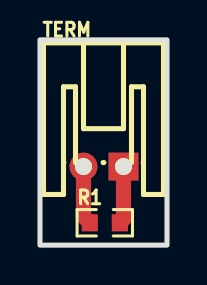
[diagram p4: board, top side]
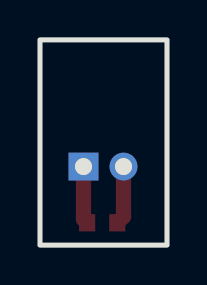
[diagram p5: board, bottom side, seen from below]

Outline 6.35 x 10.29 mm; copper layers: Top Layer, Bottom Layer. Coordinates in mm from the lower left corner of the outline.
Outline path: rectangle 0,10.29 6.35,0
Stack: Top Layer 0.035mm / Dielectric1 1.51mm FR4 er 4.5 / Bottom Layer 0.035mm

## Design rules (mm)
template: JLCPCB Capability(Two Layers Board)
spacing copperThickness1oz (default): track to track 0.102, other pairs 0.152 to 0.3
spacing copperThickness2oz: track to track 0.203, other pairs 0.152 to 0.3
track width copperThickness1oz (default): min 0.127, default 0.254, max 2.54
track width copperThickness2oz: min 0.203, default 0.254, max 2.54
differential pair differentialPair (default): width min 0.127, default 0.254, max 2.54; gap min 0.152, default 0.152
via viaSize (default): diameter min 0.5, default 0.61, max 10; hole min 0.3, default 0.305, max 6.3

## Placement (name value [footprint] x y rotation side)
R1  120R  [R0603]  3.24 1.12 0 top
TERM  S2B-PH-K-S(LF)(SN)  [CONN-TH_S2B-PH-K-S-LF-SN]  3.18 3.94 0 top

## Footprints (pads in the part's own frame, mm; a bottom-side part is the same pattern mirrored in y, then rotated)
CONN-TH_S2B-PH-K-S-LF-SN
  rect 1.5x1.4 hole 0.85: 1(1,0)
  round 1.4 hole 0.85: 2(-1,0)
R0603
  rect 0.806x0.864 smd: 1(-0.753,0) 2(0.753,0)

## Nets
As in the schematic.

## Routing (per net, layer and track width the routed paths; a pad name or vN(x,y) marks a point on that pad's centre or on a via; arc(x,y) is an arc through that point)
$1N137: length 2.9
  Top Layer w0.762: TERM.2 2.18,1.43 R1.1
$1N142: length 2.9
  Top Layer w0.762: TERM.1 4.18,1.3 R1.2
